# EAGLE schematic FDTI-UPDI example (EAGLE 7.6.0)
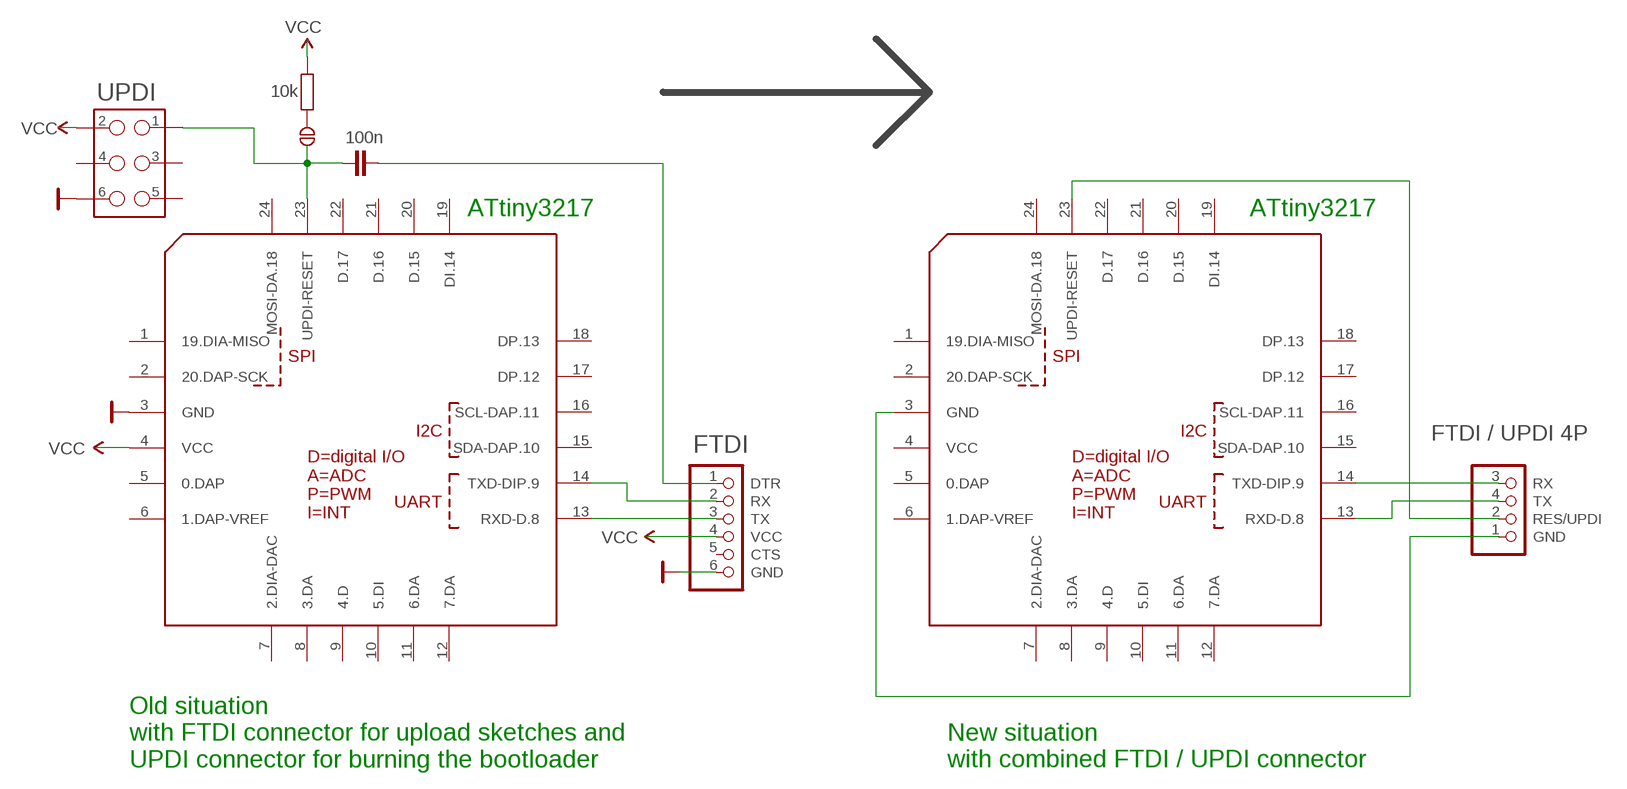
[diagram p0: schematic, sheet 1]
V1 (ARROW): VALUE: x
V2 (ARROW): VALUE: x
V3 (ARROW): VALUE: x
V4 (ARROW): VALUE: x

## Parts
C2  100n  SMD-C-0603-SMALL  [0603-SMALL]
J1  FTDI / UPDI 4P  ZIGZAG-FTDI-UPDI-4P  [ZIGZAG-FTDI-UPDI-4P]
J2  FTDI  [ZIGZAG-FTDI]
JP1  JUMPER_SJSMALL  [SJ_2S-NO-NS]
R2  10k  SMD-R-0603-SMALL  [0603-SMALL]
U1  ATTINY3217-  [QFN-24]
U2  ATtiny3217  ATTINY3217-  [QFN-24]
UPDI  M3X2"  [2X3_TEST_POINTS]

## Nets
GND: J2.6(GND) U1.3(GND) UPDI.6
N$1: J1.3(RX) U2.14(TXD-DIP.9)
N$2: J1.4(TX) U2.13(RXD-D.8)
N$3: J1.2(RES/UPDI) U2.23(UPDI-RESET)
N$4: J1.1(GND) U2.3(GND)
N$5: C2.1 JP1.1 U1.23(UPDI-RESET) UPDI.1
N$6: C2.2 J2.1(DTR)
N$7: J2.2(RX) U1.14(TXD-DIP.9)
N$8: J2.3(TX) U1.13(RXD-D.8)
N$9: JP1.2 R2.1
VCC: J2.4(VCC) U1.4(VCC) UPDI.2
Unconnected: J2.5(CTS) R2.2 U1.1(19.DIA-MISO) U1.2(20.DAP-SCK) U1.5(0.DAP) U1.6(1.DAP-VREF) U1.7(2.DIA-DAC) U1.8(3.DA) U1.9(4.D) U1.10(5.DI) U1.11(6.DA) U1.12(7.DA) U1.15(SDA-DAP.10) U1.16(SCL-DAP.11) U1.17(DP.12) U1.18(DP.13) U1.19(DI.14) U1.20(D.15) U1.21(D.16) U1.22(D.17) U1.24(MOSI-DA.18) U2.1(19.DIA-MISO) U2.2(20.DAP-SCK) U2.4(VCC) U2.5(0.DAP) U2.6(1.DAP-VREF) U2.7(2.DIA-DAC) U2.8(3.DA) U2.9(4.D) U2.10(5.DI) U2.11(6.DA) U2.12(7.DA) U2.15(SDA-DAP.10) U2.16(SCL-DAP.11) U2.17(DP.12) U2.18(DP.13) U2.19(DI.14) U2.20(D.15) U2.21(D.16) U2.22(D.17) U2.24(MOSI-DA.18) UPDI.3 UPDI.4 UPDI.5

## Notes on the sheet
- ATtiny3217 | ATtiny3217
- Old situation
  with FTDI connector for upload sketches and
  UPDI connector for burning the bootloader
- New situation
  with combined FTDI / UPDI connector

## Library data of the parts
C2 = Albert:SMD-C: Capacitors ...4.7uF @ 6.3V -> 0402 ...10uF @ 16V -> 0603 ...22uF @ 25V -> 0805
J1 = Albert:ZIGZAG-FTDI-UPDI-4P
J2 = Albert:FTDI
JP1 = Albert:JUMPER_SJ: SMD solder JUMPER
R2 = Albert:SMD-R: Resistors all kinds in 0603 and 0402
U1 U2 = Albert-Arduino:ATTINY3217: MICROCONTROLLER 4 Kbytes FLASH 128 bytes SRAM 256 bytes EEPROM UART 6-channel 10 bit ADC
UPDI = Albert:M3X2